# EAGLE design 360-wearable (EAGLE 8.2.2)
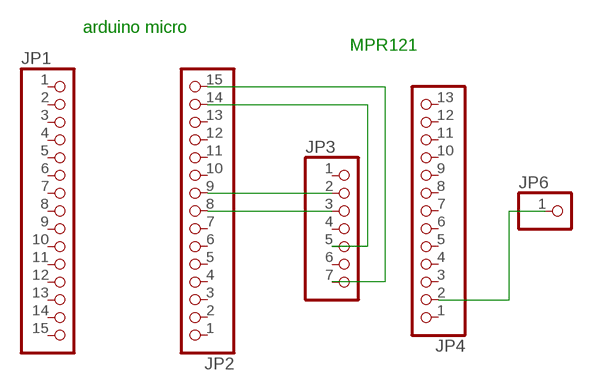
[diagram p0: schematic, sheet 1]

## Parts
JP1  PINHD-1X15  [1X15]
JP2  PINHD-1X15  [1X15]
JP3  PINHD-1X7  [1X07]
JP4  PINHD-1X13  [1X13]
JP6  PINHD-1X1  [1X01]

## Nets
N$1: JP4.2 JP6.1
N$2: JP2.15 JP3.7
N$3: JP2.14 JP3.5
N$4: JP2.9 JP3.2
N$5: JP2.8 JP3.3
Unconnected: JP1.1 JP1.2 JP1.3 JP1.4 JP1.5 JP1.6 JP1.7 JP1.8 JP1.9 JP1.10 JP1.11 JP1.12 JP1.13 JP1.14 JP1.15 JP2.1 JP2.2 JP2.3 JP2.4 JP2.5 JP2.6 JP2.7 JP2.10 JP2.11 JP2.12 JP2.13 JP3.1 JP3.4 JP3.6 JP4.1 JP4.3 JP4.4 JP4.5 JP4.6 JP4.7 JP4.8 JP4.9 JP4.10 JP4.11 JP4.12 JP4.13

## Notes on the sheet
- arduino micro
- MPR121

## Library data of the parts
JP1 JP2 = pinhead:PINHD-1X15: PIN HEADER
JP3 = pinhead:PINHD-1X7: PIN HEADER
JP4 = pinhead:PINHD-1X13: PIN HEADER
JP6 = pinhead:PINHD-1X1: PIN HEADER

## Board
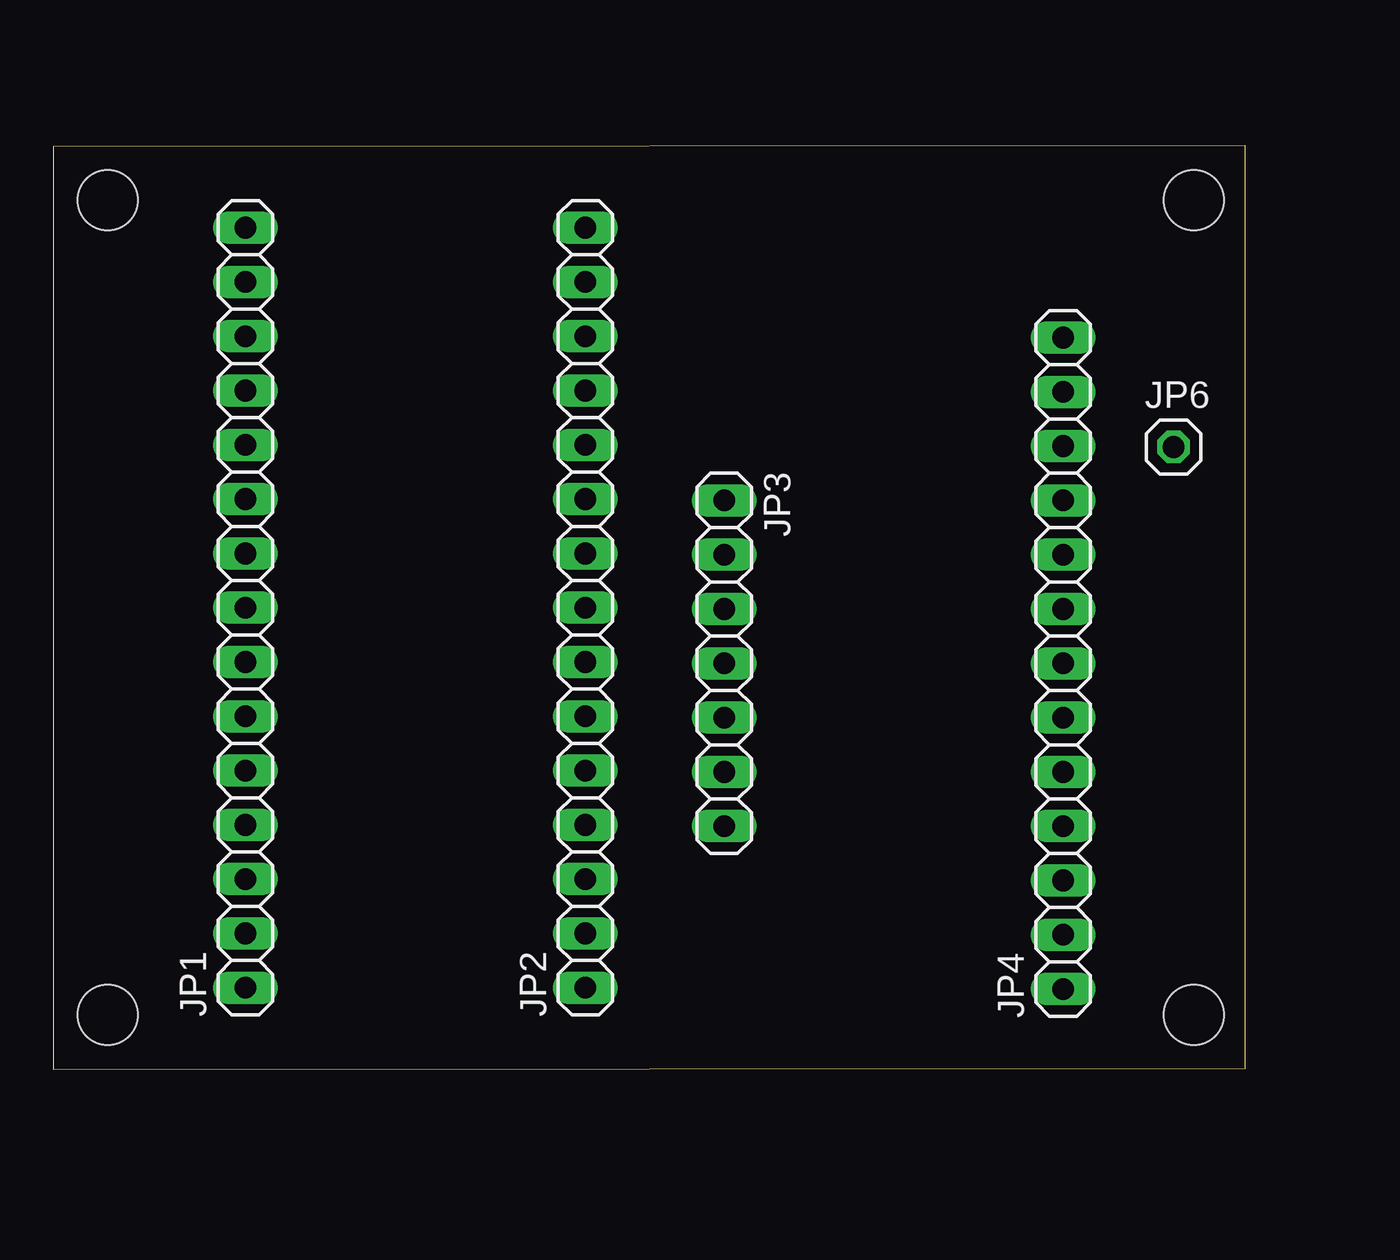
[diagram p1: board, top side]
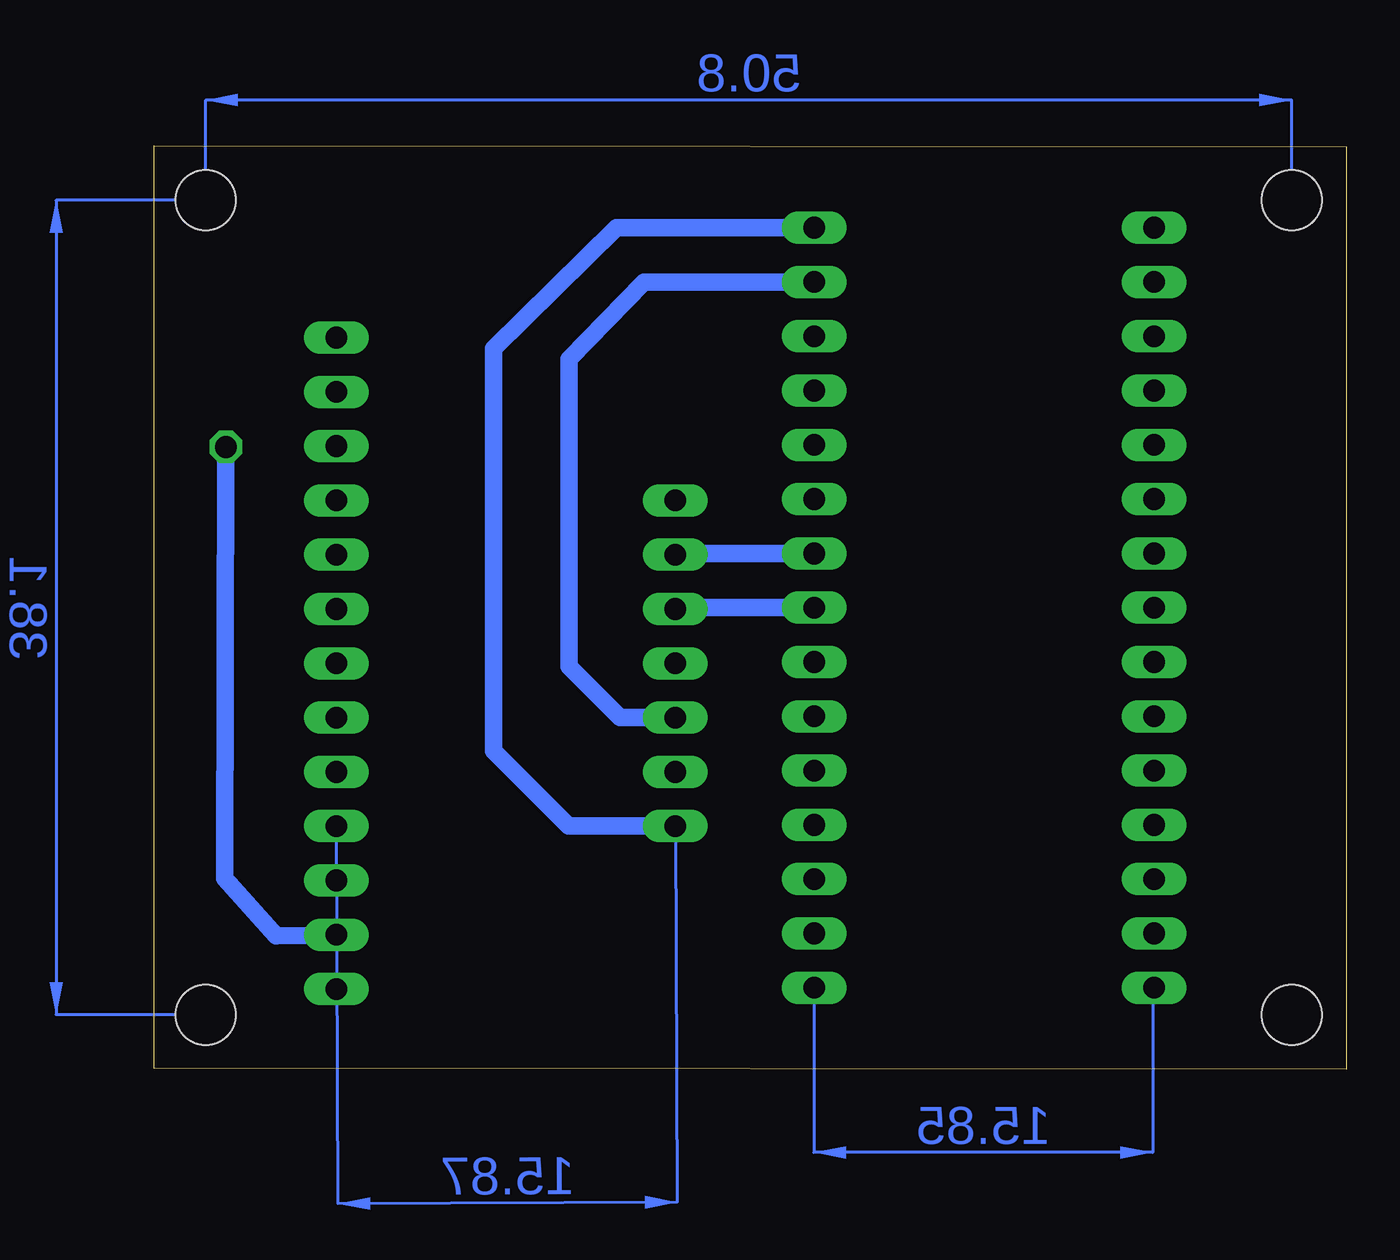
[diagram p2: board, bottom side, seen from below]

Size 55.76 x 43.22 mm. Coordinates in mm from the lower left corner, seen from the top.
Outline: 0,0 55.76,0.05 55.76,43.22 0,43.17 0,0
Copper layers (1*16): Top 0.035mm / dielectric 1.5mm / Bottom 0.035mm
Design rules "default": minimum track width 6mil, minimum drill 0.35mm, track to track 6mil, track to pad 6mil, pad to pad 6mil, via to via 6mil, smd to smd 6mil, copper to edge 40mil, drill to drill 6mil, minimum pad ring 10mil, minimum via ring 8mil, stop-mask expansion 4mil, vias tented up to drill 0mil, thermal gap 10mil
Holes 2.8 mm at 53.35,40.65 53.35,2.55 2.55,40.65 2.55,2.55

### Footprints (pad centres in the part's own frame; a part is rotated, then mirrored left to right if it is on the bottom)
1X15 = drill 1.016 long: 1 -17.78,0; 2 -15.24,0; 3 -12.7,0; 4 -10.16,0; 5 -7.62,0; 6 -5.08,0; 7 -2.54,0; 8 0,0; 9 2.54,0; 10 5.08,0; 11 7.62,0; 12 10.16,0; 13 12.7,0; 14 15.24,0; 15 17.78,0
1X07 = drill 1.016 long: 1 -7.62,0; 2 -5.08,0; 3 -2.54,0; 4 0,0; 5 2.54,0; 6 5.08,0; 7 7.62,0
1X13 = drill 1.016 long: 1 -15.24,0; 2 -12.7,0; 3 -10.16,0; 4 -7.62,0; 5 -5.08,0; 6 -2.54,0; 7 0,0; 8 2.54,0; 9 5.08,0; 10 7.62,0; 11 10.16,0; 12 12.7,0; 13 15.24,0
1X01 = drill 1.016 octagon: 1 0,0

### Placement (x,y rotation side)
JP1  8.98,21.59 90 top
JP2  24.89,21.59 90 top
JP3  31.38,18.99 270 top
JP4  47.24,18.99 90 top
JP6  52.41,29.11 0 top

### Tracks (layer width: path | path; a pad name or v marks a point on that pad's centre or on a via)
N$1
  Bottom 0.813: JP6.1 52.46,8.93 50.07,6.24 JP4.2
N$2
  Bottom 0.813: JP2.15 34.13,39.37 39.89,33.71 39.89,14.88 36.38,11.37 JP3.7
N$3
  Bottom 0.813: JP2.14 32.84,36.83 36.35,33.22 36.35,18.84 33.96,16.45 JP3.5
N$4
  Bottom 0.813: JP2.9 31.32,24.13 JP3.2
N$5
  Bottom 0.813: JP2.8 31.32,21.59 JP3.3
(copper drawn outside any net)
  shapes: Bottom area x4